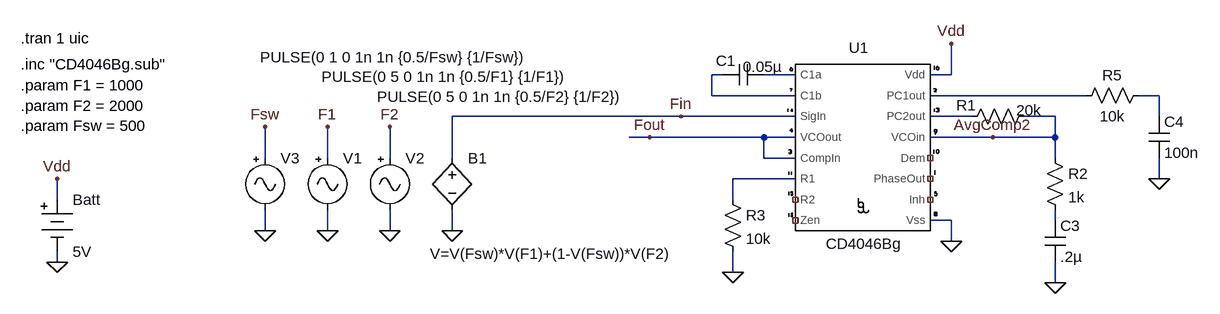
[diagram p0: schematic fractional-freq-smoother.asc]
fractional-freq-smoother.asc, the LTspice schematic file:
Version 4
SHEET 1 908 680
WIRE 0 64 -16 64
WIRE 112 64 64 64
WIRE 352 64 352 16
WIRE 352 64 320 64
WIRE -16 96 -16 64
WIRE 112 96 -16 96
WIRE 560 96 320 96
WIRE 672 96 640 96
WIRE -64 128 -416 128
WIRE 112 128 -64 128
WIRE 384 128 320 128
WIRE 512 128 464 128
WIRE 672 128 672 96
WIRE -112 160 -144 160
WIRE 64 160 -112 160
WIRE 112 160 64 160
WIRE 416 160 320 160
WIRE 512 160 512 128
WIRE 512 160 416 160
WIRE -704 192 -704 144
WIRE -608 192 -608 144
WIRE -512 192 -512 144
WIRE -416 192 -416 128
WIRE 64 192 64 160
WIRE 112 192 64 192
WIRE 512 192 512 160
WIRE 112 224 16 224
WIRE 672 224 672 192
WIRE -1024 256 -1024 224
WIRE 16 256 16 224
WIRE 352 288 320 288
WIRE 512 288 512 272
WIRE -704 304 -704 272
WIRE -608 304 -608 272
WIRE -512 304 -512 272
WIRE -416 304 -416 272
WIRE 352 320 352 288
WIRE -1024 352 -1024 336
WIRE 16 368 16 336
WIRE 512 384 512 352
FLAG -1024 352 0
FLAG -1024 224 Vdd
FLAG 352 320 0
FLAG 352 16 Vdd
FLAG 512 384 0
FLAG 16 368 0
FLAG 672 224 0
FLAG 416 160 AvgComp2
FLAG -112 160 Fout
FLAG -64 128 Fin
FLAG -608 304 0
FLAG -608 144 F1
FLAG -512 304 0
FLAG -512 144 F2
FLAG -704 304 0
FLAG -704 144 Fsw
FLAG -416 304 0
SYMBOL CD4046Bg 224 208 R0
SYMATTR InstName U1
SYMBOL cap 0 80 R270
WINDOW 0 22 5 VTop 2
WINDOW 3 44 62 VBottom 2
SYMATTR InstName C1
SYMATTR Value 0.05µ
SYMBOL Misc\\battery -1024 240 R0
WINDOW 123 0 0 Left 2
WINDOW 39 0 0 Left 2
SYMATTR InstName Batt
SYMATTR Value 5V
SYMBOL res 0 240 R0
SYMATTR InstName R3
SYMATTR Value 10k
SYMBOL cap 496 288 R0
SYMATTR InstName C3
SYMATTR Value .2µ
SYMBOL res 480 112 R90
WINDOW 0 14 105 VBottom 2
WINDOW 3 -9 8 VTop 2
SYMATTR InstName R1
SYMATTR Value 20k
SYMBOL res 656 80 R90
WINDOW 0 0 56 VBottom 2
WINDOW 3 32 56 VTop 2
SYMATTR InstName R5
SYMATTR Value 10k
SYMBOL cap 656 128 R0
SYMATTR InstName C4
SYMATTR Value 100n
SYMBOL res 496 176 R0
SYMATTR InstName R2
SYMATTR Value 1k
SYMBOL Misc\\signal -608 176 R0
WINDOW 3 -9 -109 Left 2
WINDOW 123 0 0 Left 2
WINDOW 39 0 0 Left 2
SYMATTR InstName V1
SYMATTR Value PULSE(0 5 0 1n 1n {0.5/F1} {1/F1})
SYMBOL Misc\\signal -512 176 R0
WINDOW 3 -20 -78 Left 2
WINDOW 123 0 0 Left 2
WINDOW 39 0 0 Left 2
SYMATTR InstName V2
SYMATTR Value PULSE(0 5 0 1n 1n {0.5/F2} {1/F2})
SYMBOL Misc\\signal -704 176 R0
WINDOW 3 -8 -139 Left 2
WINDOW 123 0 0 Left 2
WINDOW 39 0 0 Left 2
SYMATTR InstName V3
SYMATTR Value PULSE(0 1 0 1n 1n {0.5/Fsw} {1/Fsw})
SYMBOL bv -416 176 R0
WINDOW 3 -34 163 Left 2
SYMATTR InstName B1
SYMATTR Value V=V(Fsw)*V(F1)+(1-V(Fsw))*V(F2)
TEXT -1080 8 Left 2 !.tran 1 uic
TEXT -1080 48 Left 2 !.inc "CD4046Bg.sub"
TEXT -1080 80 Left 2 !.param F1 = 1000\n.param F2 = 2000\n.param Fsw = 500

The netlist it stands for:
* fractional-freq-smoother.asc
XU1 N002 N001 Fout NC_01 N006 NC_02 Fin AvgComp2 Vdd 0 NC_03 N003 N005 NC_04 Fout NC_05 CD4046Bg  ; pins C1a C1b CompIn Inh R1 R2 SigIn VCOin Vdd Vss Dem PC1out PC2out PhaseOut VCOout Zen
C1 N001 N002 0.05µ
V§Batt Vdd 0 5V
R3 N006 0 10k
C3 N007 0 .2µ
R1 AvgComp2 N005 20k
R5 N004 N003 10k
C4 N004 0 100n
R2 AvgComp2 N007 1k
V1 F1 0 PULSE(0 5 0 1n 1n {0.5/F1} {1/F1})
V2 F2 0 PULSE(0 5 0 1n 1n {0.5/F2} {1/F2})
V3 Fsw 0 PULSE(0 1 0 1n 1n {0.5/Fsw} {1/Fsw})
B1 Fin 0 V=V(Fsw)*V(F1)+(1-V(Fsw))*V(F2)
.tran 1 uic
.inc "CD4046Bg.sub"
.param F1 = 1000
.param F2 = 2000
.param Fsw = 500
.backanno
.end